# Altium schematic sheet Encoder.SchDoc
size A4; SheetNumber: 2; SheetTotal: 2
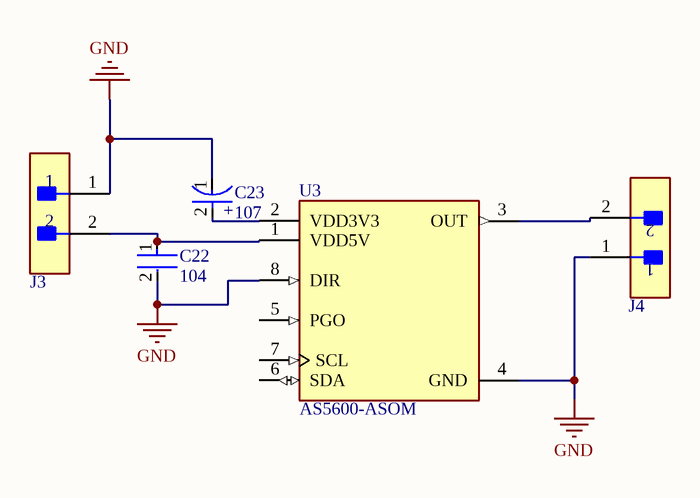
[diagram p0: Encoder.SchDoc]

## Parts
C22  104  [FP-CC0603-DA-MFG]
C23  107  [FP-T491B105K035AT-MFG]
J3  M20-9990246  [FP-M20-9990246-MFG]  (value not drawn)
J4  M20-9990246  [FP-M20-9990246-MFG]  (value not drawn)
U3  AS5600-ASOM  [FP-AS5600-ASOM-IPC_C]

## Nets
GND: C22.2 C23.1(C) J3.1 J4.1 U3.4(GND) U3.8(DIR)
NetC22_1: C22.1 J3.2 U3.1(VDD5V)
NetC23_2: C23.2(A) U3.2(VDD3V3)
NetJ4_2: J4.2 U3.3(OUT)

Not connected (* = marked no-connect by the designer): U3 5(PGO) 6(SDA) 7(SCL)

## Notes on the sheet
- (in symbol CMP-03017-000043-1) +

## Library data of the parts
C22 = CMP-2000-05002-2: CAP CER 0.1UF 16V X7R 0603; Manufacturer Part Number: CC0603KRX7R7BB104; Manufacturer: YAGEO; Tolerance: 0.1; Value: 100 nF; Temperature Coefficient: 15%; Description: CC0603 100 nF X7R 10.00% 16 V; Material: Ceramic; Voltage Rating: 16 V; Package: CC0603-DA; ComponentLink2Description: Datasheet; Octopart: https://octopart.com/cc0603krx7r7bb104-yageo-192941; Temperature Range High: +125°C; Digikey Description: CAP CER 0.1UF 16V X7R 0603; Voltage: 16 V; Device Class L2: Capacitors; Height: 0.9mm; Temperature: -55°C to +125°C; Device Class L1: Passive Components; Device Class L3: Ceramic Capacitors; ComponentLink2URL: http://www.yageo.com/documents/recent/UPY-GPHC_X7R_6.3V-to-50V_18.pdf; Footprint Url: http://www.yageo.com/exep/pages/download/literatures/UPY-C_GEN_24.pdf; RoHS: TRUE; Temperature Range Low: -55°C; Temperature Characteristic: X7R; Lead Free: Yes; Capacitance: 100 nF; Category: Cap; Mouser Description: Multilayer Ceramic Capacitor, CC Series, 0.1 - F, - 10%, X7R, 16 V, 0603 [1608 Metric]; Automotive: No
C23 = CMP-03017-000043-1: CAP TANT 1UF 10% 35V 1411; Life (Hours): 2000Hour; Dissipation Factor: 4%; Dielectric Material: Tantalum; ESR (Equivalent Series Resistance): 5R; Ripple Current: 130mA; Polarity: Polar; Leakage Current: 500nA; Tolerance: 20%; Packaging: Tape and Reel; Capacitance: 1uF; Package Quantity: 1; Case Code (Imperial): 1411; Voltage: 35V; Depth: 2.8mm; Radiation Hardening: No; Voltage Rating (DC): 35V; Max Operating Temperature: 125°C; REACH SVHC: No SVHC; Case/Package: 1411; Lead Free: Lead Free; Height - Seated (Max): 0.083inch; Length: 3.5mm; Features: General Purpose; Height: 1.9mm; Mount: Surface Mount; Voltage Rating: 35V; Min Operating Temperature: -55°C; Width: 2.8mm; Case Code (Metric): 3528; Termination: SMD/SMT; Number of Pins: 2
J3 J4 = CMP-15831-000009-1: CONN HEADER VERT 2POS 2.54MM; Manufacturer: Harwin; Conn Gender: Male; Description: Connector Header Through Hole 2 position 0.100" (2.54mm); Conn Orientation: Vertical; Number Of Contacts: 2; Current Rating: 3A; ComponentLink2URL: https://cdn.harwin.com/pdfs/M20-999.pdf; ComponentLink2Description: Datasheet; Package: M20-9990246; Temperature: -40°C to +105°C; Octopart: https://octopart.com/m20-9990246-harwin-2590635; Mouser Description: 2.54mm (0.1") Pitch SIL Vertical PC Tail Pin Header, 6.1mm mating pin height, tin, 2 contacts; Temperature Range High: +105°C; Device Class L1: Connectors; RoHS: TRUE; Automotive: No; Height: 8.99mm; Number Of Rows: 1; Contact Material: Tin,Nickel; Category: Conn; Pitch: 2.54mm; Lead Free: Yes; Digikey Description: CONN HEADER VERT 2POS 2.54MM; Manufacturer Part Number: M20-9990246; Temperature Range Low: -40°C; Device Class L3: unset; Device Class L2: Headers and Wire Housings
U3 = CMP-22826-000002-1: SENSOR ANGLE 360DEG SMD; Sensing Method: Hall Effect; Termination: SMD/SMT; Min Operating Temperature: -40°C; Mount: Surface Mount; Lead Free: Lead Free; Max Operating Temperature: 125°C